# EAGLE design Atxmega_Board (EAGLE 6.4)
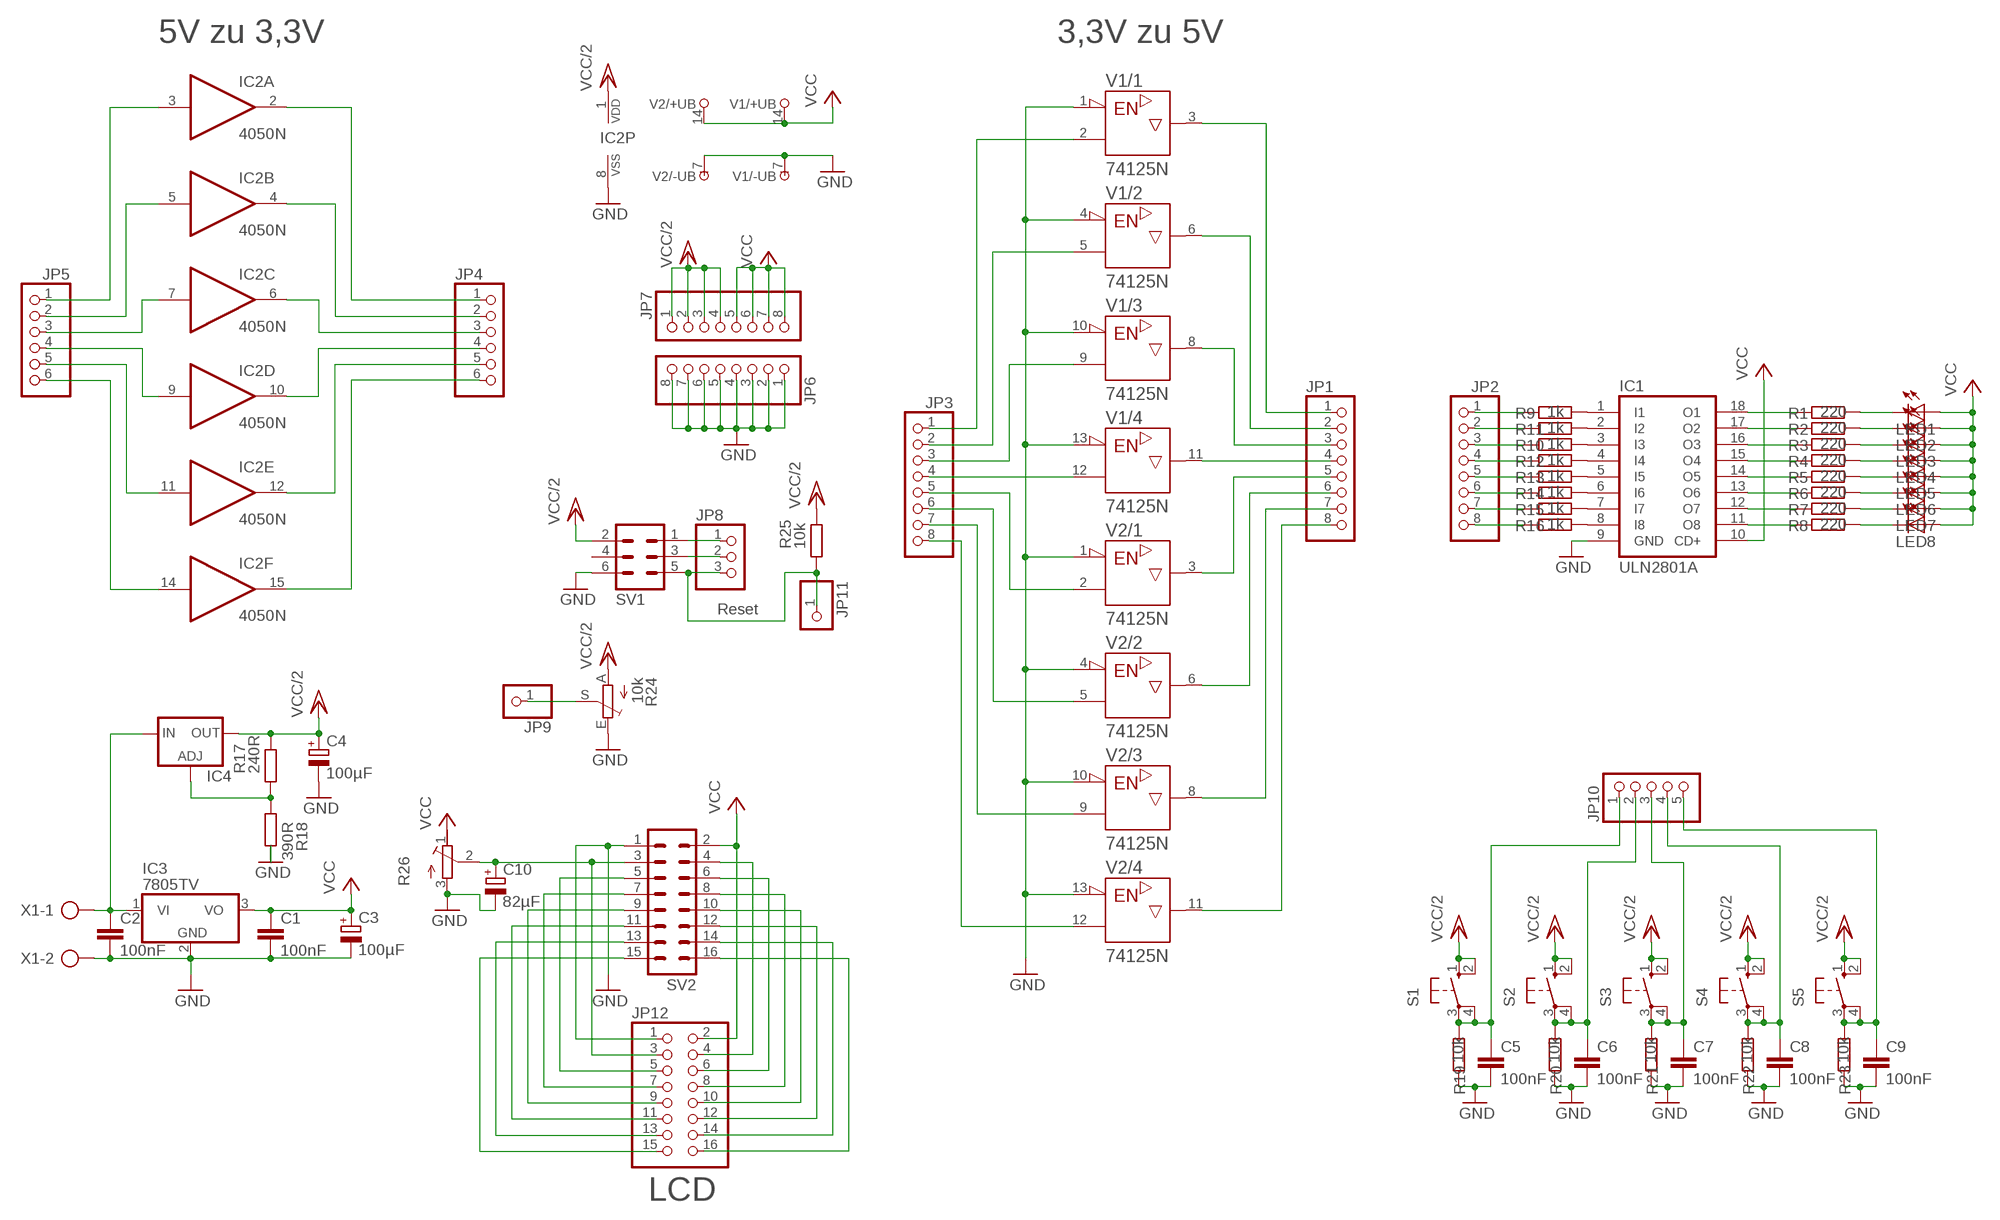
[diagram p0: schematic, sheet 1]

## Parts
C1  100nF  C-EU025_050-025X075  [C025_050-025X075]
C2  100nF  C-EU025_050-025X075  [C025_050-025X075]
C3  100µF  CPOL-EUE2.5-7  [E2,5-7]
C4  100µF  CPOL-EUE2.5-7  [E2,5-7]
C5  100nF  C-EU025_050-025X075  [C025_050-025X075]
C6  100nF  C-EU025_050-025X075  [C025_050-025X075]
C7  100nF  C-EU025_050-025X075  [C025_050-025X075]
C8  100nF  C-EU025_050-025X075  [C025_050-025X075]
C9  100nF  C-EU025_050-025X075  [C025_050-025X075]
C10  82µF  CPOL-EUE2.5-7  [E2,5-7]
IC1  ULN2801A  [DIL18]
IC2  4050N  [DIL16]
IC3  7805TV  [TO220V]
IC4  LM317TS  [317TS]
JP1  PINHD-1X8  [1X08]
JP2  PINHD-1X8  [1X08]
JP3  PINHD-1X8  [1X08]
JP4  PINHD-1X6  [1X06]
JP5  PINHD-1X6  [1X06]
JP6  PINHD-1X8  [1X08]
JP7  PINHD-1X8  [1X08]
JP8  PINHD-1X3  [1X03]
JP9  PINHD-1X1  [1X01]
JP10  PINHD-1X5  [1X05]
JP11  PINHD-1X1  [1X01]
JP12  PINHD-2X8  [2X08]
LED1  LED5MM  [LED5MM]
LED2  LED5MM  [LED5MM]
LED3  LED5MM  [LED5MM]
LED4  LED5MM  [LED5MM]
LED5  LED5MM  [LED5MM]
LED6  LED5MM  [LED5MM]
LED7  LED5MM  [LED5MM]
LED8  LED5MM  [LED5MM]
R1  220  R-EU_0207/10  [0207/10]
R2  220  R-EU_0207/10  [0207/10]
R3  220  R-EU_0207/10  [0207/10]
R4  220  R-EU_0207/10  [0207/10]
R5  220  R-EU_0207/10  [0207/10]
R6  220  R-EU_0207/10  [0207/10]
R7  220  R-EU_0207/10  [0207/10]
R8  220  R-EU_0207/10  [0207/10]
R9  1k  R-EU_0207/10  [0207/10]
R10  1k  R-EU_0207/10  [0207/10]
R11  1k  R-EU_0207/10  [0207/10]
R12  1k  R-EU_0207/10  [0207/10]
R13  1k  R-EU_0207/10  [0207/10]
R14  1k  R-EU_0207/10  [0207/10]
R15  1k  R-EU_0207/10  [0207/10]
R16  1k  R-EU_0207/10  [0207/10]
R17  240R  R-EU_0207/10  [0207/10]
R18  390R  R-EU_0207/10  [0207/10]
R19  10k  R-EU_0207/10  [0207/10]
R20  10k  R-EU_0207/10  [0207/10]
R21  10k  R-EU_0207/10  [0207/10]
R22  10k  R-EU_0207/10  [0207/10]
R23  10k  R-EU_0207/10  [0207/10]
R24  10k  TRIM_EU-ST15  [ST15]
R25  10k  R-EU_0207/10  [0207/10]
R26  R-TRIMM3006P  [RTRIM3006P]
S1  10-XX  [B3F-10XX]
S2  10-XX  [B3F-10XX]
S3  10-XX  [B3F-10XX]
S4  10-XX  [B3F-10XX]
S5  10-XX  [B3F-10XX]
SV1  ML6  [ML6]
SV2  ML16  [ML16]
V1  74125N  [DIL14]
V2  74125N  [DIL14]
X1  AK500/2  [AK500/2]

## Nets
GND: C1.2 C2.2 C3.- C4.- C5.2 C6.2 C7.2 C8.2 C9.2 C10.- IC1.9(GND) IC2.8(P:VSS) IC3.2(GND) JP6.1 JP6.2 JP6.3 JP6.4 JP6.5 JP6.6 JP6.7 JP6.8 JP12.1 R18.2 R19.1 R20.1 R21.1 R22.1 R23.1 R24.E R26.3(E) SV1.6 SV2.1 V1.1(/1:!G) V1.4(/2:!G) V1.7(/-UB:-UB) V1.10(/3:!G) V1.13(/4:!G) V2.1(/1:!G) V2.4(/2:!G) V2.7(/-UB:-UB) V2.10(/3:!G) V2.13(/4:!G) X1.2
N$1: LED1.K(C) R1.2
N$2: IC1.1(I1) R9.2
N$3: JP1.3 V1.8(/3:Y)
N$4: JP1.2 V1.6(/2:Y)
N$5: JP1.1 V1.3(/1:Y)
N$6: JP1.5 V2.3(/1:Y)
N$7: JP1.6 V2.6(/2:Y)
N$8: JP1.7 V2.8(/3:Y)
N$9: JP1.8 V2.11(/4:Y)
N$10: IC1.18(O1) R1.1
N$11: IC1.17(O2) R2.1
N$12: IC1.16(O3) R3.1
N$13: IC1.15(O4) R4.1
N$14: IC1.14(O5) R5.1
N$15: IC1.13(O6) R6.1
N$16: IC1.12(O7) R7.1
N$17: IC1.11(O8) R8.1
N$18: LED2.K(C) R2.2
N$19: LED3.K(C) R3.2
N$20: LED4.K(C) R4.2
N$21: LED5.K(C) R5.2
N$22: LED6.K(C) R6.2
N$23: LED7.K(C) R7.2
N$24: LED8.K(C) R8.2
N$25: JP8.1 SV1.1
N$26: IC1.3(I3) R10.2
N$27: IC1.2(I2) R11.2
N$28: IC1.4(I4) R12.2
N$29: IC1.5(I5) R13.2
N$30: IC1.6(I6) R14.2
N$31: IC1.7(I7) R15.2
N$32: IC1.8(I8) R16.2
N$33: JP1.4 V1.11(/4:Y)
N$34: JP2.1 R9.1
N$35: JP2.2 R11.1
N$36: JP2.3 R10.1
N$37: JP2.4 R12.1
N$38: JP2.5 R13.1
N$39: JP2.6 R14.1
N$40: JP2.7 R15.1
N$41: JP2.8 R16.1
N$42: JP3.4 V1.12(/4:A)
N$43: JP3.5 V2.2(/1:A)
N$44: JP3.6 V2.5(/2:A)
N$45: JP3.7 V2.9(/3:A)
N$46: JP3.8 V2.12(/4:A)
N$47: JP3.3 V1.9(/3:A)
N$48: JP3.2 V1.5(/2:A)
N$49: JP3.1 V1.2(/1:A)
N$50: IC2.6(C:O) JP4.3
N$51: IC2.10(D:O) JP4.4
N$52: IC2.4(B:O) JP4.2
N$53: IC2.2(A:O) JP4.1
N$54: IC2.12(E:O) JP4.5
N$55: IC2.15(F:O) JP4.6
N$56: IC2.7(C:I) JP5.3
N$57: IC2.9(D:I) JP5.4
N$58: IC2.5(B:I) JP5.2
N$59: IC2.3(A:I) JP5.1
N$60: IC2.11(E:I) JP5.5
N$61: IC2.14(F:I) JP5.6
N$62: IC4.1(ADJ) R17.1 R18.1
N$63: C2.1 IC3.1(VI) IC4.3(IN) X1.1
N$64: C5.1 JP10.1 R19.2 S1.3(P) S1.4(P1)
N$65: C6.1 JP10.2 R20.2 S2.3(P) S2.4(P1)
N$66: C7.1 JP10.3 R21.2 S3.3(P) S3.4(P1)
N$67: C8.1 JP10.4 R22.2 S4.3(P) S4.4(P1)
N$68: C9.1 JP10.5 R23.2 S5.3(P) S5.4(P1)
N$69: JP8.2 SV1.3
N$72: JP9.1 R24.S
N$73: JP8.3 JP11.1 R25.1 SV1.5
N$74: C10.+ JP12.3 R26.2(S) SV2.3
N$75: JP12.5 SV2.5
N$76: JP12.7 SV2.7
N$77: JP12.9 SV2.9
N$78: JP12.11 SV2.11
N$79: JP12.13 SV2.13
N$80: JP12.15 SV2.15
N$81: JP12.4 SV2.4
N$82: JP12.6 SV2.6
N$83: JP12.8 SV2.8
N$84: JP12.10 SV2.10
N$85: JP12.12 SV2.12
N$86: JP12.14 SV2.14
N$87: JP12.16 SV2.16
VCC: C1.1 C3.+ IC1.10(CD+) IC3.3(VO) JP7.5 JP7.6 JP7.7 JP7.8 JP12.2 LED1.A LED2.A LED3.A LED4.A LED5.A LED6.A LED7.A LED8.A R26.1(A) SV2.2 V1.14(/+UB:+UB) V2.14(/+UB:+UB)
VCC/2: C4.+ IC2.1(P:VDD) IC4.2(OUT) JP7.1 JP7.2 JP7.3 JP7.4 R17.2 R24.A R25.2 S1.1(S) S1.2(S1) S2.1(S) S2.2(S1) S3.1(S) S3.2(S1) S4.1(S) S4.2(S1) S5.1(S) S5.2(S1) SV1.2
Unconnected: SV1.4

## Notes on the sheet
- 5V zu 3,3V | 3,3V zu 5V
- Reset
- LCD

## Library data of the parts
C1 C2 C5-C9 = rcl:C-EU: CAPACITOR, European symbol
C3 C4 C10 = rcl:CPOL-EU: POLARIZED CAPACITOR, European symbol
IC1 = uln-udn:ULN2801A: DRIVER ARRAY
IC2 = 40xx:4050: Hex non-inverting BUFFER
IC3 = linear:78*: Positive VOLTAGE REGULATOR Source: http://cache.national.com/ds/LM/LM78L05.pdf http://www.fairchildsemi.com/ds/LM/LM7805.pdf
IC4 = v-reg:LM317TS: VOLTAGE REGULATOR
JP1-JP3 JP6 JP7 = pinhead:PINHD-1X8: PIN HEADER
JP4 JP5 = pinhead:PINHD-1X6: PIN HEADER
JP8 = pinhead:PINHD-1X3: PIN HEADER
JP9 JP11 = pinhead:PINHD-1X1: PIN HEADER
JP10 = pinhead:PINHD-1X5: PIN HEADER
JP12 = pinhead:PINHD-2X8: PIN HEADER
LED1-LED8 = led:LED: LED OSRAM: - CHIPLED LG R971, LG N971, LY N971, LG Q971, LY Q971, LO R971, LY R971 LH N974, LH R974 LS Q976, LO Q976, LY Q976 LO Q996 - Hyper CHIPLED LW Q18S LB Q993, LB Q99A, LB R99A - SideLED LS A670, LO A670, LY A670, LG A670, LP A670 LB A673, LV A673, LT A673, LW A673 LH A674 LY A675 LS A676, LA A676, LO A676, LY A676, LW A676 LS A679, LY A679, LG A679 - Hyper Micro SIDELED® LS Y876, LA Y876, LO Y876, LY Y876 LT Y87S - SmartLED LW L88C, LW L88S LB L89C, LB L89S, LG L890 LS L89K, LO L89K, LY L89K LS L896, LA L896, LO L896, LY L896 - TOPLED LS T670, LO T670, LY T670, LG T670, LP T670 LSG T670, LSP T670, LSY T670, LOP T670, LYG T670 LG T671, LOG T671, LSG T671 LB T673, LV T673, LT T673, LW T673 LH T674 LS T676, LA T676, LO T676, LY T676, LB T676, LH T676, LSB T676, LW T676 LB T67C, LV T67C, LT T67C, LS T67K, LO T67K, LY T67K, LW E67C LS E67B, LA E67B, LO E67B, LY E67B, LB E67C, LV E67C, LT E67C LW T67C LS T679, LY T679, LG T679 LS T770, LO T770, LY T770, LG T770, LP T770 LB T773, LV T773, LT T773, LW T773 LH T774 LS E675, LA E675, LY E675, LS T675 LS T776, LA T776, LO T776, LY T776, LB T776 LHGB T686 LT T68C, LB T68C - Hyper Mini TOPLED® LB M676 - Mini TOPLED Santana® LG M470 LS M47K, LO M47K, LY M47K Source: http://www.osram.convergy.de LUXEON: - LUMILED® LXK2-PW12-R00, LXK2-PW12-S00, LXK2-PW14-U00, LXK2-PW14-V00 LXK2-PM12-R00, LXK2-PM12-S00, LXK2-PM14-U00 LXK2-PE12-Q00, LXK2-PE12-R00, LXK2-PE12-S00, LXK2-PE14-T00, LXK2-PE14-U00 LXK2-PB12-K00, LXK2-PB12-L00, LXK2-PB12-M00, LXK2-PB14-N00, LXK2-PB14-P00, LXK2-PB14-Q00 LXK2-PR12-L00, LXK2-PR12-M00, LXK2-PR14-Q00, LXK2-PR14-R00 LXK2-PD12-Q00, LXK2-PD12-R00, LXK2-PD12-S00 LXK2-PH12-R00, LXK2-PH12-S00 LXK2-PL12-P00, LXK2-PL12-Q00, LXK2-PL12-R00 Source: www.luxeon.com KINGBRIGHT: KA-3528ASYC Source: www.kingbright.com
R1-R23 R25 = resistor:R-EU_: RESISTOR, European symbol
R24 = pot:TRIM_EU-: POTENTIOMETER
R26 = resistor:R-TRIMM: Trimm resistor
S1-S5 = switch-omron:10-XX: OMRON SWITCH; MPN: B3F-1000; OC_FARNELL: 176432; OC_NEWARK: 36M3542
SV1 = con-harting-ml:ML6: HARTING; OC_FARNELL: unknown; OC_NEWARK: unknown
SV2 = con-harting-ml:ML16: HARTING; OC_FARNELL: unknown; OC_NEWARK: unknown
V1 V2 = 74ttl-din:74*125: Quad bus BUFFER, 3-state
X1 = con-ptr500:AK500/2: CONNECTOR; OC_FARNELL: unknown; OC_NEWARK: unknown

## Board
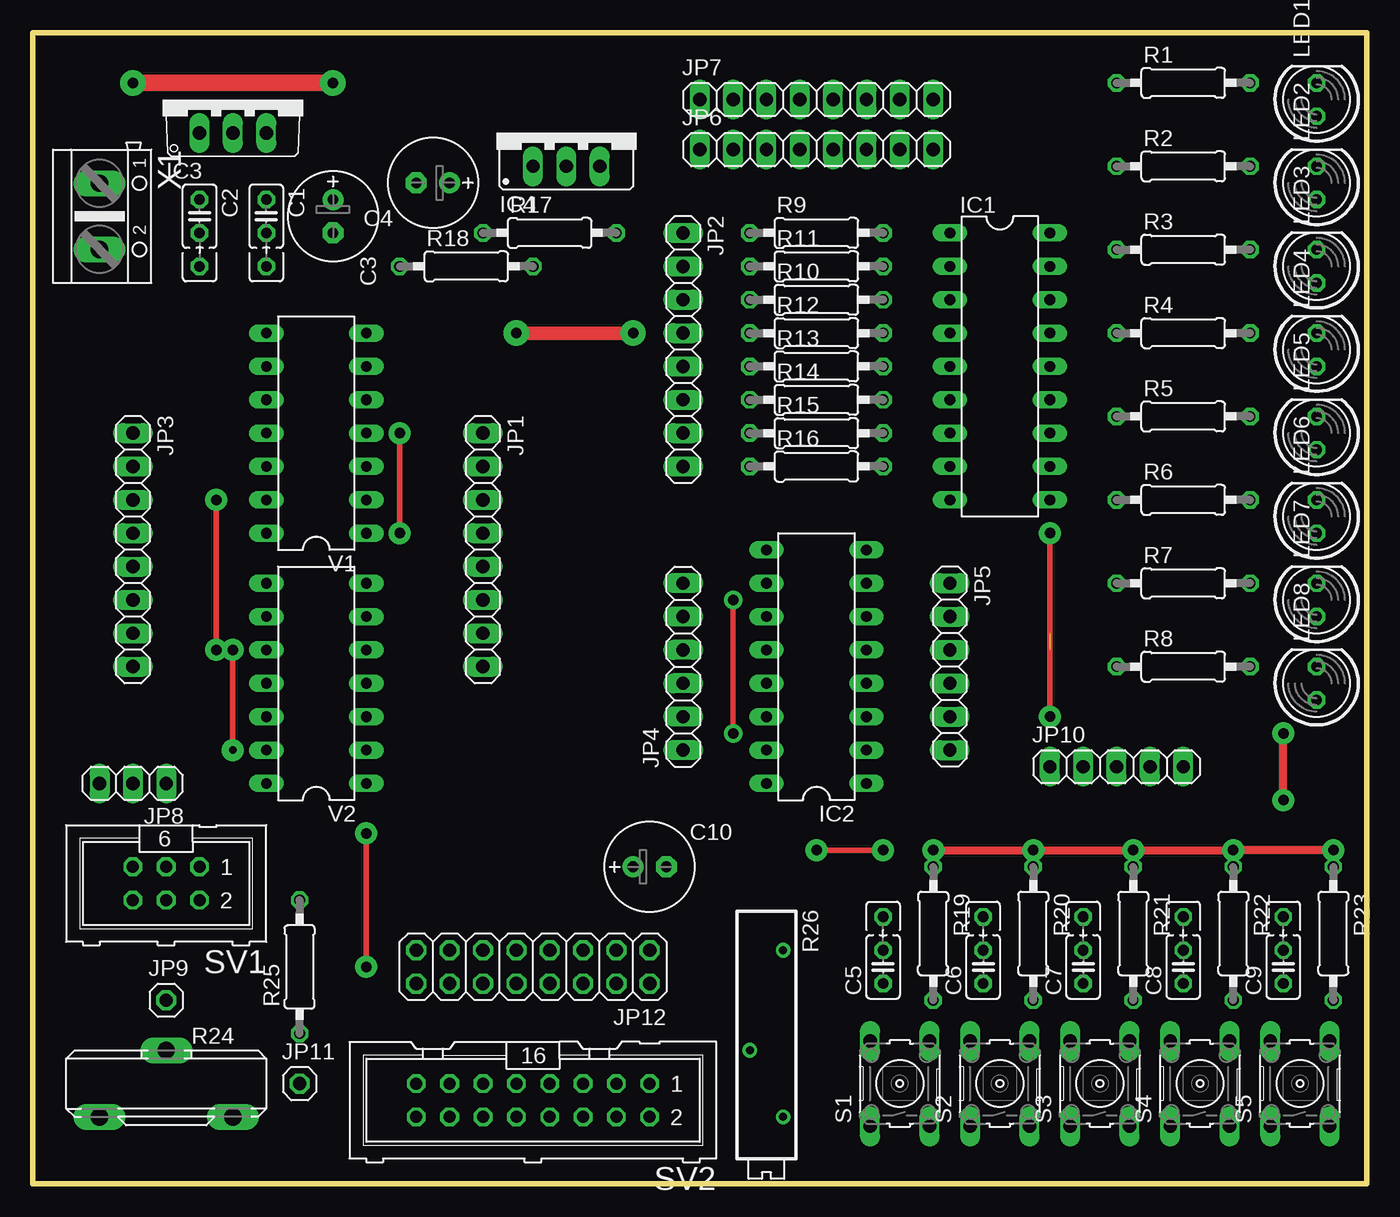
[diagram p1: board, top side]
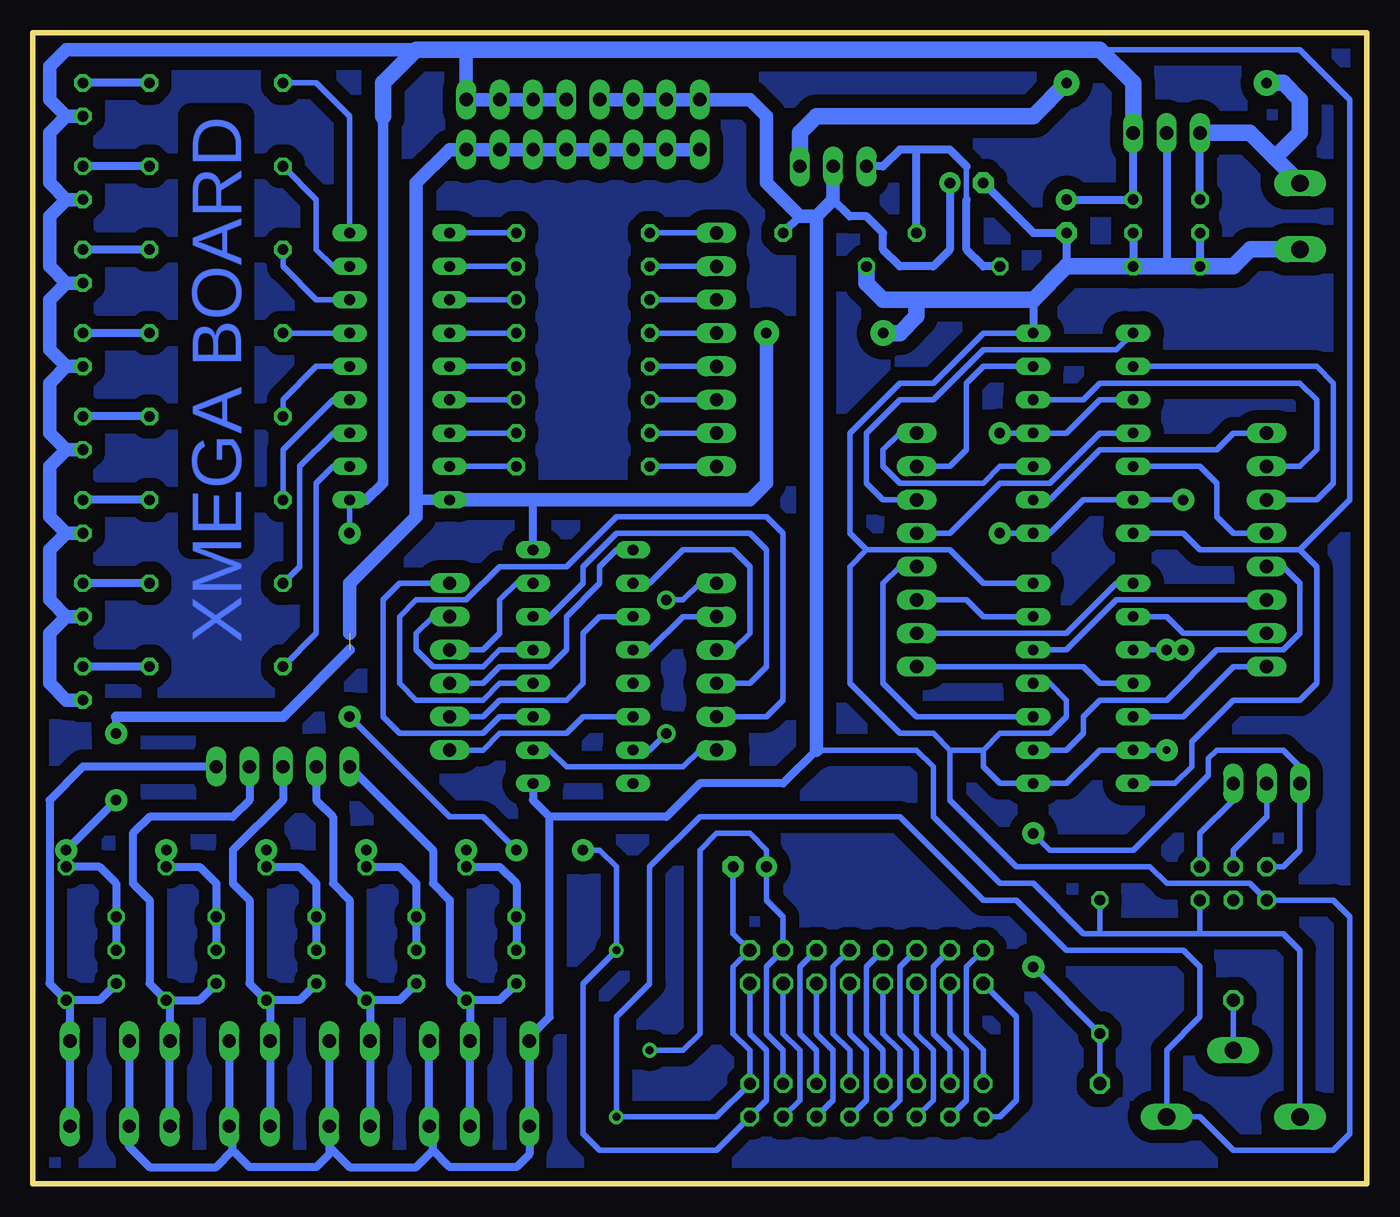
[diagram p2: board, bottom side, seen from below]

Size 101.6 x 87.63 mm. Coordinates in mm from the lower left corner, seen from the top.
Outline: 101.6,87.63 101.6,0 0,0 0,87.63 101.6,87.63
Copper layers (1*16): Top 0.035mm / dielectric 1.5mm / Bottom 0.035mm
Design rules "default": minimum track width 10mil, minimum drill 24mil, track to track 8mil, track to pad 8mil, pad to pad 8mil, via to via 8mil, smd to smd 8mil, copper to edge 40mil, drill to drill 8mil, minimum pad ring 10mil, minimum via ring 8mil, stop-mask expansion 4mil, vias tented up to drill 0mil, thermal gap 10mil

### Footprints (pad centres in the part's own frame; a part is rotated, then mirrored left to right if it is on the bottom)
C025_050-025X075 = drill 0.813 octagon: 1 -1.27,0; 2 1.27,0; 3 3.81,0
E2,5-7 = drill 0.813 pad 1.6: + -1.27,0 | drill 0.813 pad 1.6 octagon: - 1.27,0
DIL18 = drill 0.813 long: 1 -10.16,-3.81; 2 -7.62,-3.81; 3 -5.08,-3.81; 4 -2.54,-3.81; 5 0,-3.81; 6 2.54,-3.81; 7 5.08,-3.81; 8 7.62,-3.81; 9 10.16,-3.81; 10 10.16,3.81; 11 7.62,3.81; 12 5.08,3.81; 13 2.54,3.81; 14 0,3.81; 15 -2.54,3.81; 16 -5.08,3.81; 17 -7.62,3.81; 18 -10.16,3.81
DIL16 = drill 0.813 long: 1 -8.89,-3.81; 2 -6.35,-3.81; 3 -3.81,-3.81; 4 -1.27,-3.81; 5 1.27,-3.81; 6 3.81,-3.81; 7 6.35,-3.81; 8 8.89,-3.81; 9 8.89,3.81; 10 6.35,3.81; 11 3.81,3.81; 12 1.27,3.81; 13 -1.27,3.81; 14 -3.81,3.81; 15 -6.35,3.81; 16 -8.89,3.81
TO220V = drill 1.016 long: 1 -2.54,-2.54; 2 0,-2.54; 3 2.54,-2.54
317TS = drill 1.016 long: 1 -2.54,-2.54; 2 0,-2.54; 3 2.54,-2.54
1X08 = drill 1.016 long: 1 -8.89,0; 2 -6.35,0; 3 -3.81,0; 4 -1.27,0; 5 1.27,0; 6 3.81,0; 7 6.35,0; 8 8.89,0
1X06 = drill 1.016 long: 1 -6.35,0; 2 -3.81,0; 3 -1.27,0; 4 1.27,0; 5 3.81,0; 6 6.35,0
1X03 = drill 1.016 long: 1 -2.54,0; 2 0,0; 3 2.54,0
1X01 = drill 1.016 octagon: 1 0,0
1X05 = drill 1.016 long: 1 -5.08,0; 2 -2.54,0; 3 0,0; 4 2.54,0; 5 5.08,0
2X08 = drill 1.016 octagon: 1 -8.89,-1.27; 2 -8.89,1.27; 3 -6.35,-1.27; 4 -6.35,1.27; 5 -3.81,-1.27; 6 -3.81,1.27; 7 -1.27,-1.27; 8 -1.27,1.27; 9 1.27,-1.27; 10 1.27,1.27; 11 3.81,-1.27; 12 3.81,1.27; 13 6.35,-1.27; 14 6.35,1.27; 15 8.89,-1.27; 16 8.89,1.27
LED5MM = drill 0.813 octagon: A -1.27,0; K 1.27,0
0207/10 = drill 0.813 octagon: 1 -5.08,0; 2 5.08,0
ST15 = drill 1.321 long: A -5.08,-2.54; E 5.08,-2.54; S 0,2.54
RTRIM3006P = drill 0.61: 1 -7.62,1.27; 2 0,-1.27; 3 5.08,1.27
B3F-10XX = drill 1.016 long: 1 -3.251,2.261; 2 3.251,2.261; 3 -3.251,-2.261; 4 3.251,-2.261
ML6 = drill 0.914 octagon: 1 -2.54,-1.27; 2 -2.54,1.27; 3 0,-1.27; 4 0,1.27; 5 2.54,-1.27; 6 2.54,1.27
ML16 = drill 0.914 octagon: 1 -8.89,-1.27; 2 -8.89,1.27; 3 -6.35,-1.27; 4 -6.35,1.27; 5 -3.81,-1.27; 6 -3.81,1.27; 7 -1.27,-1.27; 8 -1.27,1.27; 9 1.27,-1.27; 10 1.27,1.27; 11 3.81,-1.27; 12 3.81,1.27; 13 6.35,-1.27; 14 6.35,1.27; 15 8.89,-1.27; 16 8.89,1.27
DIL14 = drill 0.813 long: 1 -7.62,-3.81; 2 -5.08,-3.81; 3 -2.54,-3.81; 4 0,-3.81; 5 2.54,-3.81; 6 5.08,-3.81; 7 7.62,-3.81; 8 7.62,3.81; 9 5.08,3.81; 10 2.54,3.81; 11 0,3.81; 12 -2.54,3.81; 13 -5.08,3.81; 14 -7.62,3.81
AK500/2 = drill 1.321 long: 1 -2.515,0; 2 2.515,0

### Placement (x,y rotation side)
C1  17.78,73.66 270 top
C2  12.7,73.66 270 top
C3  22.86,73.66 270 top
C4  30.48,76.2 180 top
C5  64.77,16.51 90 top
C6  72.39,16.51 90 top
C7  80.01,16.51 90 top
C8  87.63,16.51 90 top
C9  95.25,16.51 90 top
C10  46.99,24.13 0 top
IC1  73.66,62.23 270 top
IC2  59.69,39.37 90 top
IC3  15.24,82.55 0 top
IC4  40.64,80.01 0 top
JP1  34.29,48.26 270 top
JP2  49.53,63.5 270 top
JP3  7.62,48.26 270 top
JP4  49.53,39.37 90 top
JP5  69.85,39.37 270 top
JP6  59.69,78.74 0 top
JP7  59.69,82.55 0 top
JP8  7.62,30.48 180 top
JP9  10.16,13.97 0 top
JP10  82.55,31.75 0 top
JP11  20.32,7.62 0 top
JP12  38.1,16.51 180 top
LED1  97.79,82.55 90 top
LED2  97.79,76.2 90 top
LED3  97.79,69.85 90 top
LED4  97.79,63.5 90 top
LED5  97.79,57.15 90 top
LED6  97.79,50.8 90 top
LED7  97.79,44.45 90 top
LED8  97.79,38.1 90 top
R1  87.63,83.82 0 top
R2  87.63,77.47 0 top
R3  87.63,71.12 0 top
R4  87.63,64.77 0 top
R5  87.63,58.42 0 top
R6  87.63,52.07 0 top
R7  87.63,45.72 0 top
R8  87.63,39.37 0 top
R9  59.69,72.39 0 top
R10  59.69,67.31 0 top
R11  59.69,69.85 0 top
R12  59.69,64.77 0 top
R13  59.69,62.23 0 top
R14  59.69,59.69 0 top
R15  59.69,57.15 0 top
R16  59.69,54.61 0 top
R17  39.37,72.39 0 top
R18  33.02,69.85 0 top
R19  68.58,19.05 270 top
R20  76.2,19.05 270 top
R21  83.82,19.05 270 top
R22  91.44,19.05 270 top
R23  99.06,19.05 270 top
R24  10.16,7.62 0 top
R25  20.32,16.51 90 top
R26  55.88,10.16 270 top
S1  66.04,7.62 90 top
S2  73.66,7.62 90 top
S3  81.28,7.62 90 top
S4  88.9,7.62 90 top
S5  96.52,7.62 90 top
SV1  10.16,22.86 180 top
SV2  38.1,6.35 180 top
V1  21.59,57.15 90 top
V2  21.59,38.1 90 top
X1  5.08,73.66 270 top

### Tracks (layer width: path | path; a pad name or v marks a point on that pad's centre or on a via)
GND  (via drill 0.6 pad 1.68, 0.8 pad 1.68, 0.8 pad 1.93)  (1 unrouted)
  Top 0.406: v15.24,40.64 v15.24,33.02 | v27.94,57.15 v27.94,49.53 | v13.97,40.64 v13.97,52.07
  Top 0.61: v68.58,25.4 v76.2,25.4 v83.82,25.4 v91.44,25.4 v99.06,25.4 | v95.25,29.21 v95.25,34.29
  Top 1.016: v45.72,64.77 v36.83,64.77
  Bottom 0.406: V1.7 29.21,64.77 33.02,60.96 35.56,60.96 39.37,57.15 39.37,49.53 38.1,48.26 | 38.1,48.26 31.75,48.26 29.21,45.72 V2.7 | 38.1,48.26 39.37,46.99 39.37,38.1 35.56,34.29 33.02,34.29 31.75,33.02 | 31.75,33.02 31.75,29.21 26.67,24.13 16.51,24.13 15.24,22.86 8.89,22.86 SV1.6 2.54,21.59 1.27,20.32 1.27,3.81 2.54,2.54 10.16,2.54 12.7,5.08 R24.E 15.24,10.16 12.7,12.7 12.7,16.51 13.97,17.78 22.86,17.78 26.67,21.59 29.21,21.59 35.56,27.94 50.8,27.94 54.61,24.13 54.61,15.24 57.15,12.7 R26.3 49.53,5.08 SV2.1 46.99,10.16 48.26,11.43 48.26,16.51 JP12.1 48.26,19.05 C10.- | V1.10 20.32,59.69 22.86,57.15 V1.4 v27.94,57.15 | V2.4 24.13,38.1 22.86,36.83 22.86,35.56 24.13,34.29 27.94,34.29 29.21,33.02 | 29.21,33.02 29.21,31.75 27.94,30.48 V2.1 22.86,30.48 20.32,33.02 V2.13 v15.24,33.02 | v15.24,40.64 V2.10 v13.97,40.64 | v27.94,49.53 V1.1 24.13,49.53 21.59,52.07 V1.13 v13.97,52.07 | 29.21,33.02 31.75,33.02
  Bottom 0.61: IC3.2 15.24,69.85 | C2.2 12.7,69.85 | C1.2 17.78,69.85 | 22.86,69.85 C3.- 25.4,72.39 C4.- | 25.4,67.31 V1.7 | IC2.8 63.5,52.07 | C5.2 64.77,22.86 66.04,24.13 R19.1 v68.58,25.4 | C6.2 72.39,22.86 73.66,24.13 R20.1 v76.2,25.4 | C7.2 80.01,22.86 81.28,24.13 R21.1 v83.82,25.4 | C8.2 87.63,22.86 88.9,24.13 R22.1 v91.44,25.4 | C9.2 95.25,22.86 96.52,24.13 R23.1 v99.06,25.4 v95.25,29.21 | v95.25,34.29 95.25,35.56
  Bottom 0.813: 95.25,35.56 82.55,35.56 77.47,40.64 | 72.39,52.07 IC1.9
  Bottom 1.016: JP6.1 JP6.2 JP6.3 JP6.4 JP6.5 JP6.6 JP6.7 JP6.8 69.85,78.74 72.39,76.2 72.39,52.07 72.39,50.8 77.47,45.72 77.47,41.91 | IC1.9 63.5,52.07 46.99,52.07 45.72,53.34 v45.72,64.77
  Bottom 1.27: X1.2 8.87,71.15 10.16,69.85 12.7,69.85 15.24,69.85 17.78,69.85 22.86,69.85 25.4,67.31 34.29,67.31 | 34.29,67.31 36.83,67.31 38.1,68.58 R18.2 | v36.83,64.77 35.56,64.77 34.29,66.04 34.29,67.31
N$1
  Bottom 0.61: R1.2 LED1.K
N$2
  Bottom 0.406: IC1.1 R9.2
N$3
  Bottom 0.406: JP1.3 36.83,52.07 38.1,53.34 38.1,57.15 35.56,59.69 33.02,59.69 29.21,63.5 19.05,63.5 V1.8
N$4
  Bottom 0.406: JP1.2 31.75,54.61 30.48,55.88 30.48,60.96 29.21,62.23 V1.6
N$5
  Bottom 0.406: JP1.1 35.56,57.15 36.83,55.88 36.83,54.61 35.56,53.34 29.21,53.34 27.94,54.61 V1.3
N$6
  Bottom 0.406: JP1.5 35.56,46.99 36.83,45.72 36.83,38.1 34.29,35.56 V2.3
N$7
  Bottom 0.406: JP1.6 30.48,44.45 29.21,43.18 V2.6
N$8
  Bottom 0.406: JP1.7 22.86,41.91 19.05,45.72 V2.8
N$9
  Bottom 0.406: JP1.8 21.59,39.37 20.32,38.1 V2.11
N$10
  Bottom 0.406: R1.1 80.01,83.82 77.47,81.28 IC1.18
N$11
  Bottom 0.406: IC1.17 78.74,69.85 80.01,71.12 80.01,74.93 R2.1
N$12
  Bottom 0.406: R3.1 82.55,69.85 80.01,67.31 IC1.16
N$13
  Bottom 0.406: R4.1 IC1.15
N$14
  Bottom 0.406: R5.1 82.55,59.69 80.01,62.23 IC1.14
N$15
  Bottom 0.406: IC1.13 78.74,59.69 82.55,55.88 R6.1
N$16
  Bottom 0.406: R7.1 81.28,46.99 81.28,54.61 78.74,57.15 IC1.12
N$17
  Bottom 0.406: R8.1 80.01,41.91 80.01,53.34 78.74,54.61 IC1.11
N$18
  Bottom 0.61: R2.2 LED2.K
N$19
  Bottom 0.61: R3.2 LED3.K
N$20
  Bottom 0.61: R4.2 LED4.K
N$21
  Bottom 0.61: R5.2 LED5.K
N$22
  Bottom 0.61: R6.2 LED6.K
N$23
  Bottom 0.61: R7.2 LED7.K
N$24
  Bottom 0.61: R8.2 LED8.K
N$25
  Bottom 0.406: JP8.1 10.16,29.21 12.7,26.67 SV1.1
N$26
  Bottom 0.406: IC1.3 R10.2
N$27
  Bottom 0.406: IC1.2 R11.2
N$28
  Bottom 0.406: IC1.4 R12.2
N$29
  Bottom 0.406: IC1.5 R13.2
N$30
  Bottom 0.406: IC1.6 R14.2
N$31
  Bottom 0.406: IC1.7 R15.2
N$32
  Bottom 0.406: IC1.8 R16.2
N$33
  Bottom 0.406: JP1.4 31.75,49.53 27.94,53.34 24.13,53.34 20.32,57.15 V1.11
N$34
  Bottom 0.406: R9.1 JP2.1
N$35
  Bottom 0.406: R11.1 JP2.2
N$36
  Bottom 0.406: R10.1 JP2.3
N$37
  Bottom 0.406: R12.1 JP2.4
N$38
  Bottom 0.406: R13.1 JP2.5
N$39
  Bottom 0.406: R14.1 JP2.6
N$40
  Bottom 0.406: R15.1 JP2.7
N$41
  Bottom 0.406: R16.1 JP2.8
N$42
  Bottom 0.406: JP3.4 10.16,49.53 11.43,50.8 11.43,53.34 12.7,54.61 V1.12
N$43
  Bottom 0.406: V2.2 22.86,33.02 21.59,34.29 21.59,35.56 20.32,36.83 15.24,36.83 11.43,40.64 6.35,40.64 5.08,41.91 5.08,45.72 6.35,46.99 JP3.5
N$44
  Bottom 0.406: V2.5 22.86,40.64 19.05,44.45 JP3.6
N$45
  Bottom 0.406: V2.9 15.24,43.18 13.97,41.91 JP3.7
N$46
  Bottom 0.406: V2.12 13.97,35.56 10.16,39.37 JP3.8
N$47
  Bottom 0.406: JP3.3 3.81,52.07 2.54,53.34 2.54,60.96 3.81,62.23 V1.9
N$48
  Bottom 0.406: JP3.2 5.08,54.61 3.81,55.88 3.81,59.69 5.08,60.96 20.32,60.96 21.59,59.69 V1.5
N$49
  Bottom 0.406: JP3.1 10.16,57.15 11.43,55.88 20.32,55.88 24.13,52.07 V1.2
N$50
  Bottom 0.406: IC2.6 62.23,43.18 59.69,45.72 59.69,46.99 57.15,49.53 46.99,49.53 45.72,48.26 45.72,39.37 46.99,38.1 JP4.3
N$51
  Bottom 0.406: JP4.4 48.26,40.64 46.99,41.91 46.99,46.99 48.26,48.26 52.07,48.26 54.61,45.72 IC2.10
N$52
  Bottom 0.406: JP4.2 45.72,35.56 44.45,36.83 44.45,49.53 45.72,50.8 57.15,50.8 60.96,46.99 66.04,46.99 68.58,44.45 72.39,44.45 73.66,43.18 73.66,38.1 72.39,36.83 67.31,36.83 66.04,38.1 IC2.4
N$53
  Bottom 0.406: IC2.2 62.23,33.02 60.96,31.75 52.07,31.75 50.8,33.02 JP4.1
N$54
  Bottom 0.406: IC2.12 54.61,40.64 52.07,43.18 JP4.5
N$55  (via drill 0.8 pad 1.42)
  Top 0.406: v53.34,34.29 v53.34,44.45
  Bottom 0.406: IC2.15 54.61,33.02 v53.34,34.29 | v53.34,44.45 52.07,44.45 50.8,45.72 JP4.6
N$56
  Bottom 0.406: JP5.3 67.31,40.64 66.04,41.91 66.04,44.45 64.77,45.72 IC2.7
N$57
  Bottom 0.406: JP5.4 67.31,38.1 66.04,39.37 62.23,39.37 60.96,40.64 60.96,43.18 58.42,45.72 58.42,46.99 57.15,48.26 IC2.9
N$58
  Bottom 0.406: 68.58,43.18 JP5.2 71.12,43.18 72.39,41.91 72.39,40.64 71.12,39.37 67.31,39.37 66.04,40.64 IC2.5
N$59
  Bottom 0.406: IC2.3 66.04,35.56 67.31,34.29 73.66,34.29 74.93,35.56 74.93,44.45 73.66,45.72 JP5.1 71.12,45.72
N$60
  Bottom 0.406: JP5.5 67.31,35.56 66.04,36.83 60.96,36.83 59.69,38.1 59.69,41.91 58.42,43.18 IC2.11
N$61
  Bottom 0.406: JP5.6 67.31,33.02 66.04,34.29 60.96,34.29 59.69,35.56 IC2.14
N$62
  Bottom 0.406: 30.48,74.93 30.48,77.47
  Bottom 0.61: IC4.1 36.83,77.47 35.56,78.74 34.29,78.74 | R18.1 29.21,69.85 30.48,71.12 30.48,74.93 | 30.48,77.47 31.75,78.74 34.29,78.74 | R17.1 34.29,78.74
N$63  (via drill 0.8 pad 1.93)
  Top 1.27: v22.86,83.82 v7.62,83.82
  Bottom 0.61: C2.1 IC3.1
  Bottom 1.27: v22.86,83.82 25.4,81.28 41.91,81.28 43.18,80.01 IC4.3 | X1.1 5.08,76.2 6.99,78.11 | 6.99,78.11 8.89,80.01 IC3.1 | v7.62,83.82 6.35,83.82 5.08,82.55 5.08,80.01 6.99,78.11
N$64
  Bottom 0.61: R19.2 68.3,13.69 S1.4 S1.3 | C5.1 66.04,13.97 R19.2 | R19.2 69.85,15.24 69.85,21.59 71.12,22.86 71.12,25.4 JP10.1
N$65
  Bottom 0.61: R20.2 75.92,13.69 S2.4 S2.3 | C6.1 73.66,13.97 R20.2 | JP10.2 80.01,29.21 78.74,27.94 78.74,22.86 77.47,21.59 77.47,15.24 R20.2
N$66
  Bottom 0.61: R21.2 83.54,13.69 S3.4 S3.3 | C7.1 81.28,13.97 R21.2 | JP10.3 82.55,29.21 86.36,25.4 86.36,22.86 85.09,21.59 85.09,15.24 R21.2
N$67
  Bottom 0.61: R22.2 88.9,13.97 C8.1 | R22.2 91.16,13.69 S4.4 S4.3 | JP10.4 85.09,29.21 86.36,27.94 92.71,27.94 93.98,26.67 93.98,22.86 92.71,21.59 92.71,15.24 R22.2
N$68
  Bottom 0.61: R23.2 98.78,13.69 S5.4 S5.3 98.78,4.09 | C9.1 96.52,13.97 R23.2 | JP10.5 97.79,31.75 100.33,29.21 100.33,15.24 R23.2
N$69
  Bottom 0.406: JP8.2 7.62,27.94 10.16,25.4 SV1.3
N$71
  pour Bottom (isolate 1.016): 0,87.63 101.6,87.63 101.6,0 0,0
N$72
  Bottom 0.406: JP9.1 R24.S
N$73  (via drill 0.8 pad 1.68)
  Top 0.406: v25.4,16.51 v25.4,26.67
  Bottom 0.406: SV1.5 6.35,24.13 5.08,25.4 JP8.3 5.08,31.75 6.35,33.02 11.43,33.02 12.07,32.38 12.07,31.11 17.78,25.4 24.13,25.4 v25.4,26.67 | JP11.1 R25.1 v25.4,16.51
N$74
  Bottom 0.406: SV2.3 44.45,10.16 45.72,11.43 45.72,16.51 JP12.3 44.45,20.32 45.72,21.59 C10.+ 45.72,25.4 46.99,26.67 49.53,26.67 50.8,25.4 50.8,11.43 52.07,10.16 R26.2
N$75
  Bottom 0.406: JP12.5 43.18,16.51 43.18,11.43 41.91,10.16 SV2.5
N$76
  Bottom 0.406: JP12.7 40.64,16.51 40.64,11.43 39.37,10.16 SV2.7
N$77
  Bottom 0.406: JP12.9 38.1,16.51 38.1,11.43 36.83,10.16 SV2.9
N$78
  Bottom 0.406: JP12.11 35.56,16.51 35.56,11.43 34.29,10.16 SV2.11
N$79
  Bottom 0.406: JP12.13 33.02,16.51 33.02,11.43 31.75,10.16 SV2.13
N$80
  Bottom 0.406: SV2.15 29.21,10.16 30.48,11.43 30.48,16.51 JP12.15
N$81
  Bottom 0.406: JP12.4 44.45,11.43 43.18,10.16 43.18,6.35 SV2.4
N$82
  Bottom 0.406: JP12.6 41.91,11.43 40.64,10.16 40.64,6.35 SV2.6
N$83
  Bottom 0.406: JP12.8 39.37,11.43 38.1,10.16 38.1,6.35 SV2.8
N$84
  Bottom 0.406: JP12.10 36.83,11.43 35.56,10.16 35.56,6.35 SV2.10
N$85
  Bottom 0.406: JP12.12 34.29,11.43 33.02,10.16 33.02,6.35 SV2.12
N$86
  Bottom 0.406: JP12.14 31.75,11.43 30.48,10.16 30.48,6.35 SV2.14
N$87
  Bottom 0.406: JP12.16 26.67,12.7 26.67,6.35 27.94,5.08 SV2.16
VCC  (via drill 0.8 pad 1.68)
  Top 0.406: v59.69,25.4 v64.77,25.4 | v77.47,35.56 v77.47,49.53
  Bottom 0.406: 5.08,48.26 3.81,46.99 3.81,38.1 5.08,36.83 10.16,36.83 13.34,33.66 13.34,31.75 14.61,30.48 V2.14 16.51,30.48 | 74.93,53.34 74.93,72.39 | V1.14 13.97,49.53 12.7,48.26 5.08,48.26 | 5.08,48.26 1.27,52.07 1.27,82.55 5.08,86.36 20.32,86.36 | JP12.2 46.99,11.43 45.72,10.16 45.72,6.35 SV2.2 49.53,2.54 58.42,2.54 59.69,3.81 59.69,15.24 R26.1 57.15,24.13 58.42,25.4 v59.69,25.4 | v64.77,25.4 67.31,27.94 69.85,27.94 v77.47,35.56 | v77.47,49.53 IC1.10
  Bottom 0.61: C3.+ C1.1 IC3.3
  Bottom 0.813: IC1.10 76.2,52.07 74.93,53.34 74.93,81.28
  Bottom 1.016: JP7.5 JP7.6 JP7.7 JP7.8 68.58,86.36 | 72.39,86.36 99.06,86.36 100.33,85.09 100.33,82.55 99.06,81.28 | LED1.A 99.06,81.28 | 99.06,81.28 100.33,80.01 100.33,76.2 99.06,74.93 | LED2.A 99.06,74.93 | 99.06,74.93 100.33,73.66 100.33,69.85 99.06,68.58 | LED3.A 99.06,68.58 | 99.06,68.58 100.33,67.31 100.33,63.5 99.06,62.23 | LED4.A 99.06,62.23 | 99.06,62.23 100.33,60.96 100.33,57.15 99.06,55.88 | LED5.A 99.06,55.88 | 99.06,55.88 100.33,54.61 100.33,50.8 99.06,49.53 | LED6.A 99.06,49.53 | 99.06,49.53 100.33,48.26 100.33,44.45 99.06,43.18 | LED7.A 99.06,43.18 | 99.06,43.18 100.33,41.91 100.33,38.1 99.06,36.83 LED8.A
  Bottom 1.27: IC3.3 17.78,83.82 20.32,86.36 68.58,86.36 72.39,86.36 74.93,83.82 74.93,81.28
VCC/2
  Bottom 0.406: 12.7,19.05 6.35,19.05 5.08,17.78 R24.A | 41.91,33.02 34.29,33.02 33.02,31.75 33.02,27.94 27.94,22.86 25.4,22.86 21.59,19.05 20.32,19.05 | SV1.2 12.7,19.05 | 20.32,19.05 12.7,19.05 | R25.2 20.32,19.05
  Bottom 0.61: C4.+ 31.75,71.12 33.02,69.85 35.56,69.85 36.83,71.12 36.83,72.39 38.1,73.66 39.37,73.66 40.64,74.93 | 43.18,73.66 R17.2 | IC2.1 63.5,29.21 62.23,27.94 | 41.91,33.02 44.45,30.48 50.8,30.48 53.34,27.94 62.23,27.94 | S1.1 S1.2 | S2.2 S2.1 71.12,4.09 71.12,2.54 | S4.2 S4.1 86.36,4.09 86.36,2.54 | S5.1 S5.2 94.26,2.82 92.71,1.27 87.63,1.27 86.36,2.54 | S1.2 63.78,2.26 64.77,1.27 69.85,1.27 71.12,2.54 | S3.2 S3.1 | S3.1 79.02,2.82 77.47,1.27 72.39,1.27 71.12,2.54 | S3.1 79.02,2.26 80.01,1.27 85.09,1.27 86.36,2.54 | S1.2 63.78,11.15 62.23,12.7 62.23,27.94
  Bottom 1.016: IC4.2 40.64,74.93 41.91,73.66 | 41.91,73.66 43.18,73.66 45.72,76.2 45.72,81.28 46.99,82.55 JP7.1 JP7.2 JP7.3 JP7.4 | 41.91,33.02 41.91,73.66

### Text on the board
Bottom: XMEGA BOARD